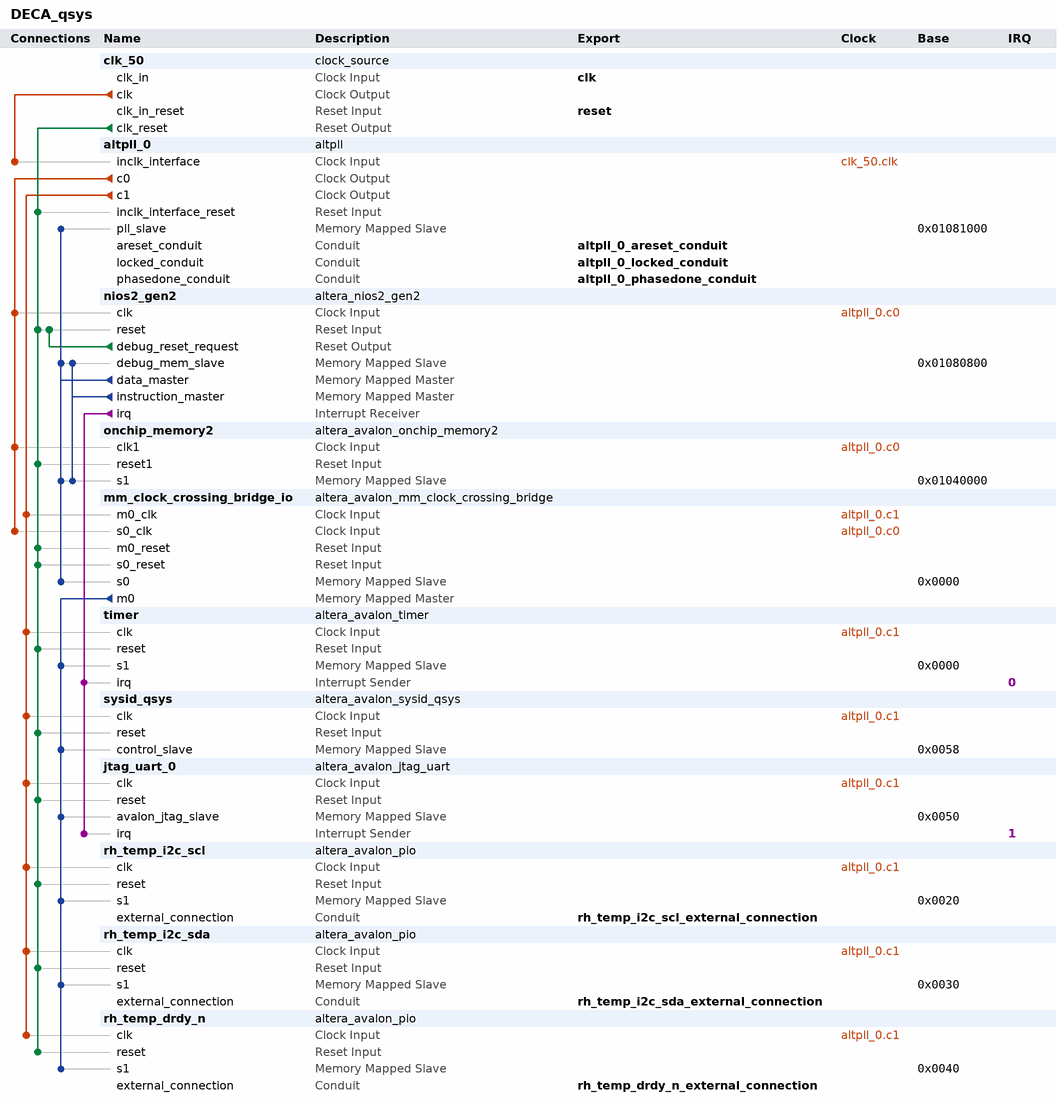
[diagram p0: system contents]
# Platform Designer (Qsys) system DECA_qsys, MAX 10 10M50DAF484C6GES
# Parameters at their usual value, and those the tool derives, are not listed.
package require -exact qsys 15.0
create_system DECA_qsys
set_project_property DEVICE_FAMILY {MAX 10}
set_project_property DEVICE 10M50DAF484C6GES

add_instance clk_50 clock_source 15.0
set_instance_parameter_value clk_50 clockFrequency 50000000

add_instance altpll_0 altpll 15.0
set_instance_parameter_value altpll_0 CLK0_DIVIDE_BY 1
set_instance_parameter_value altpll_0 CLK0_MULTIPLY_BY 2
set_instance_parameter_value altpll_0 CLK1_DIVIDE_BY 1
set_instance_parameter_value altpll_0 CLK1_DUTY_CYCLE 50
set_instance_parameter_value altpll_0 CLK1_MULTIPLY_BY 1
set_instance_parameter_value altpll_0 CLK1_PHASE_SHIFT 0
set_instance_parameter_value altpll_0 INCLK0_INPUT_FREQUENCY 20000
set_instance_parameter_value altpll_0 PORT_ARESET PORT_USED
set_instance_parameter_value altpll_0 PORT_LOCKED PORT_USED
set_instance_parameter_value altpll_0 PORT_clk1 PORT_USED
set_instance_parameter_value altpll_0 PORT_clk2 PORT_UNUSED
set_instance_parameter_value altpll_0 PORT_clk3 PORT_UNUSED

add_instance nios2_gen2 altera_nios2_gen2 15.0
set_instance_parameter_value nios2_gen2 dcache_size 2048
set_instance_parameter_value nios2_gen2 exceptionSlave onchip_memory2.s1
set_instance_parameter_value nios2_gen2 icache_size 4096
set_instance_parameter_value nios2_gen2 impl Fast
set_instance_parameter_value nios2_gen2 resetSlave onchip_memory2.s1

add_instance onchip_memory2 altera_avalon_onchip_memory2 15.0
set_instance_parameter_value onchip_memory2 dataWidth 32
set_instance_parameter_value onchip_memory2 dualPort false
set_instance_parameter_value onchip_memory2 initMemContent false
set_instance_parameter_value onchip_memory2 initializationFileName onchip_mem.hex
set_instance_parameter_value onchip_memory2 memorySize 160000

add_instance mm_clock_crossing_bridge_io altera_avalon_mm_clock_crossing_bridge 15.0
set_instance_parameter_value mm_clock_crossing_bridge_io ADDRESS_WIDTH 10
set_instance_parameter_value mm_clock_crossing_bridge_io COMMAND_FIFO_DEPTH 4
set_instance_parameter_value mm_clock_crossing_bridge_io DATA_WIDTH 32
set_instance_parameter_value mm_clock_crossing_bridge_io MASTER_SYNC_DEPTH 2
set_instance_parameter_value mm_clock_crossing_bridge_io MAX_BURST_SIZE 1
set_instance_parameter_value mm_clock_crossing_bridge_io RESPONSE_FIFO_DEPTH 4
set_instance_parameter_value mm_clock_crossing_bridge_io SLAVE_SYNC_DEPTH 2
set_instance_parameter_value mm_clock_crossing_bridge_io USE_AUTO_ADDRESS_WIDTH 1

add_instance timer altera_avalon_timer 15.0
set_instance_parameter_value timer period 1
set_instance_parameter_value timer periodUnits MSEC

add_instance sysid_qsys altera_avalon_sysid_qsys 15.0
set_instance_parameter_value sysid_qsys id 0

add_instance jtag_uart_0 altera_avalon_jtag_uart 15.0
set_instance_parameter_value jtag_uart_0 simInteractiveOptions NO_INTERACTIVE_WINDOWS

add_instance rh_temp_i2c_scl altera_avalon_pio 15.0
set_instance_parameter_value rh_temp_i2c_scl direction Output
set_instance_parameter_value rh_temp_i2c_scl width 1

add_instance rh_temp_i2c_sda altera_avalon_pio 15.0
set_instance_parameter_value rh_temp_i2c_sda direction Bidir
set_instance_parameter_value rh_temp_i2c_sda width 1

add_instance rh_temp_drdy_n altera_avalon_pio 15.0
set_instance_parameter_value rh_temp_drdy_n direction Input
set_instance_parameter_value rh_temp_drdy_n width 1

# connections
add_connection altpll_0.c0 mm_clock_crossing_bridge_io.s0_clk clock
add_connection altpll_0.c0 nios2_gen2.clk clock
add_connection altpll_0.c0 onchip_memory2.clk1 clock
add_connection altpll_0.c1 jtag_uart_0.clk clock
add_connection altpll_0.c1 mm_clock_crossing_bridge_io.m0_clk clock
add_connection altpll_0.c1 rh_temp_drdy_n.clk clock
add_connection altpll_0.c1 rh_temp_i2c_scl.clk clock
add_connection altpll_0.c1 rh_temp_i2c_sda.clk clock
add_connection altpll_0.c1 sysid_qsys.clk clock
add_connection altpll_0.c1 timer.clk clock
add_connection clk_50.clk altpll_0.inclk_interface clock
add_connection clk_50.clk_reset altpll_0.inclk_interface_reset reset
add_connection clk_50.clk_reset jtag_uart_0.reset reset
add_connection clk_50.clk_reset mm_clock_crossing_bridge_io.m0_reset reset
add_connection clk_50.clk_reset mm_clock_crossing_bridge_io.s0_reset reset
add_connection clk_50.clk_reset nios2_gen2.reset reset
add_connection clk_50.clk_reset onchip_memory2.reset1 reset
add_connection clk_50.clk_reset rh_temp_drdy_n.reset reset
add_connection clk_50.clk_reset rh_temp_i2c_scl.reset reset
add_connection clk_50.clk_reset rh_temp_i2c_sda.reset reset
add_connection clk_50.clk_reset sysid_qsys.reset reset
add_connection clk_50.clk_reset timer.reset reset
add_connection nios2_gen2.debug_reset_request nios2_gen2.reset reset
add_connection mm_clock_crossing_bridge_io.m0 jtag_uart_0.avalon_jtag_slave avalon
set_connection_parameter_value mm_clock_crossing_bridge_io.m0/jtag_uart_0.avalon_jtag_slave baseAddress 0x0050
add_connection mm_clock_crossing_bridge_io.m0 rh_temp_drdy_n.s1 avalon
set_connection_parameter_value mm_clock_crossing_bridge_io.m0/rh_temp_drdy_n.s1 baseAddress 0x0040
add_connection mm_clock_crossing_bridge_io.m0 rh_temp_i2c_scl.s1 avalon
set_connection_parameter_value mm_clock_crossing_bridge_io.m0/rh_temp_i2c_scl.s1 baseAddress 0x0020
add_connection mm_clock_crossing_bridge_io.m0 rh_temp_i2c_sda.s1 avalon
set_connection_parameter_value mm_clock_crossing_bridge_io.m0/rh_temp_i2c_sda.s1 baseAddress 0x0030
add_connection mm_clock_crossing_bridge_io.m0 sysid_qsys.control_slave avalon
set_connection_parameter_value mm_clock_crossing_bridge_io.m0/sysid_qsys.control_slave baseAddress 0x0058
add_connection mm_clock_crossing_bridge_io.m0 timer.s1 avalon
set_connection_parameter_value mm_clock_crossing_bridge_io.m0/timer.s1 baseAddress 0x0000
add_connection nios2_gen2.data_master altpll_0.pll_slave avalon
set_connection_parameter_value nios2_gen2.data_master/altpll_0.pll_slave baseAddress 0x01081000
add_connection nios2_gen2.data_master mm_clock_crossing_bridge_io.s0 avalon
set_connection_parameter_value nios2_gen2.data_master/mm_clock_crossing_bridge_io.s0 baseAddress 0x0000
add_connection nios2_gen2.data_master nios2_gen2.debug_mem_slave avalon
set_connection_parameter_value nios2_gen2.data_master/nios2_gen2.debug_mem_slave baseAddress 0x01080800
add_connection nios2_gen2.data_master onchip_memory2.s1 avalon
set_connection_parameter_value nios2_gen2.data_master/onchip_memory2.s1 baseAddress 0x01040000
add_connection nios2_gen2.instruction_master nios2_gen2.debug_mem_slave avalon
set_connection_parameter_value nios2_gen2.instruction_master/nios2_gen2.debug_mem_slave baseAddress 0x01080800
add_connection nios2_gen2.instruction_master onchip_memory2.s1 avalon
set_connection_parameter_value nios2_gen2.instruction_master/onchip_memory2.s1 baseAddress 0x01040000
add_connection nios2_gen2.irq jtag_uart_0.irq interrupt
set_connection_parameter_value nios2_gen2.irq/jtag_uart_0.irq irqNumber 1
add_connection nios2_gen2.irq timer.irq interrupt
set_connection_parameter_value nios2_gen2.irq/timer.irq irqNumber 0

# exported interfaces
add_interface altpll_0_areset_conduit conduit end
set_interface_property altpll_0_areset_conduit EXPORT_OF altpll_0.areset_conduit
add_interface altpll_0_locked_conduit conduit end
set_interface_property altpll_0_locked_conduit EXPORT_OF altpll_0.locked_conduit
add_interface altpll_0_phasedone_conduit conduit end
set_interface_property altpll_0_phasedone_conduit EXPORT_OF altpll_0.phasedone_conduit
add_interface clk clock sink
set_interface_property clk EXPORT_OF clk_50.clk_in
add_interface reset reset sink
set_interface_property reset EXPORT_OF clk_50.clk_in_reset
add_interface rh_temp_drdy_n_external_connection conduit end
set_interface_property rh_temp_drdy_n_external_connection EXPORT_OF rh_temp_drdy_n.external_connection
add_interface rh_temp_i2c_scl_external_connection conduit end
set_interface_property rh_temp_i2c_scl_external_connection EXPORT_OF rh_temp_i2c_scl.external_connection
add_interface rh_temp_i2c_sda_external_connection conduit end
set_interface_property rh_temp_i2c_sda_external_connection EXPORT_OF rh_temp_i2c_sda.external_connection

set_interconnect_requirement {$system} qsys_mm.clockCrossingAdapter HANDSHAKE
set_interconnect_requirement {$system} qsys_mm.insertDefaultSlave FALSE
set_interconnect_requirement {$system} qsys_mm.maxAdditionalLatency 1

save_system DECA_qsys.qsys
